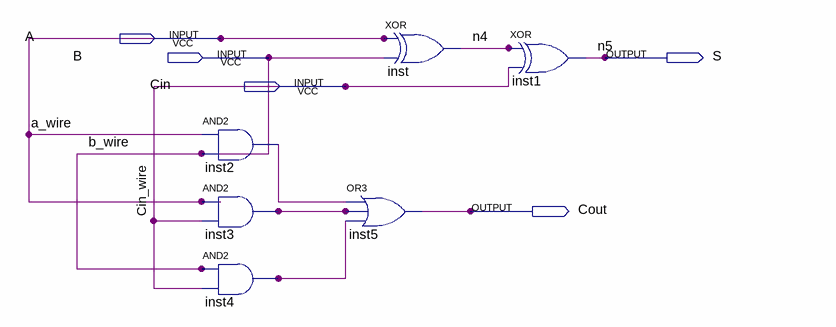
[diagram p0: schematic sheet]
// Quartus schematic project01_al.bdf as structural Verilog: 6 symbols, 5 pins
module project01_al (
  input  A,
  input  B,
  input  Cin,
  output S,
  output Cout
);

  wire inst2_out, inst3_out, inst4_out, n4;

  and inst2 (inst2_out, A, B);
  and inst3 (inst3_out, A, Cin);
  and inst4 (inst4_out, B, Cin);
  or inst5 (Cout, inst2_out, inst3_out, inst4_out);
  xor inst (n4, A, B);
  xor inst1 (S, n4, Cin);

  // Other names for the same wires on the sheet: a_wire = A; b_wire = B; Cin_wire = Cin; n5 = S
endmodule
